# Altium schematic sheet SY_HR08_MCU_POWER_V1.1.SchDoc
size A3; PageSetup: Record=PageOptions|CenterHorizontal=True|CenterVertical=True|PrintScale=0.71|XCorrection=1.00|YCorrection=1.00|PrintKind=2|BorderSize=5000000|LeftOffset=0|BottomOffset=0|Orientation=2|PaperLength=1000|PaperWidth=1000|Scale=100|PaperSource=7|PrintQuality=-3|MediaType=1|DitherType=10|PrintScaleMode=1|PaperKind=A4|PaperIndex=9
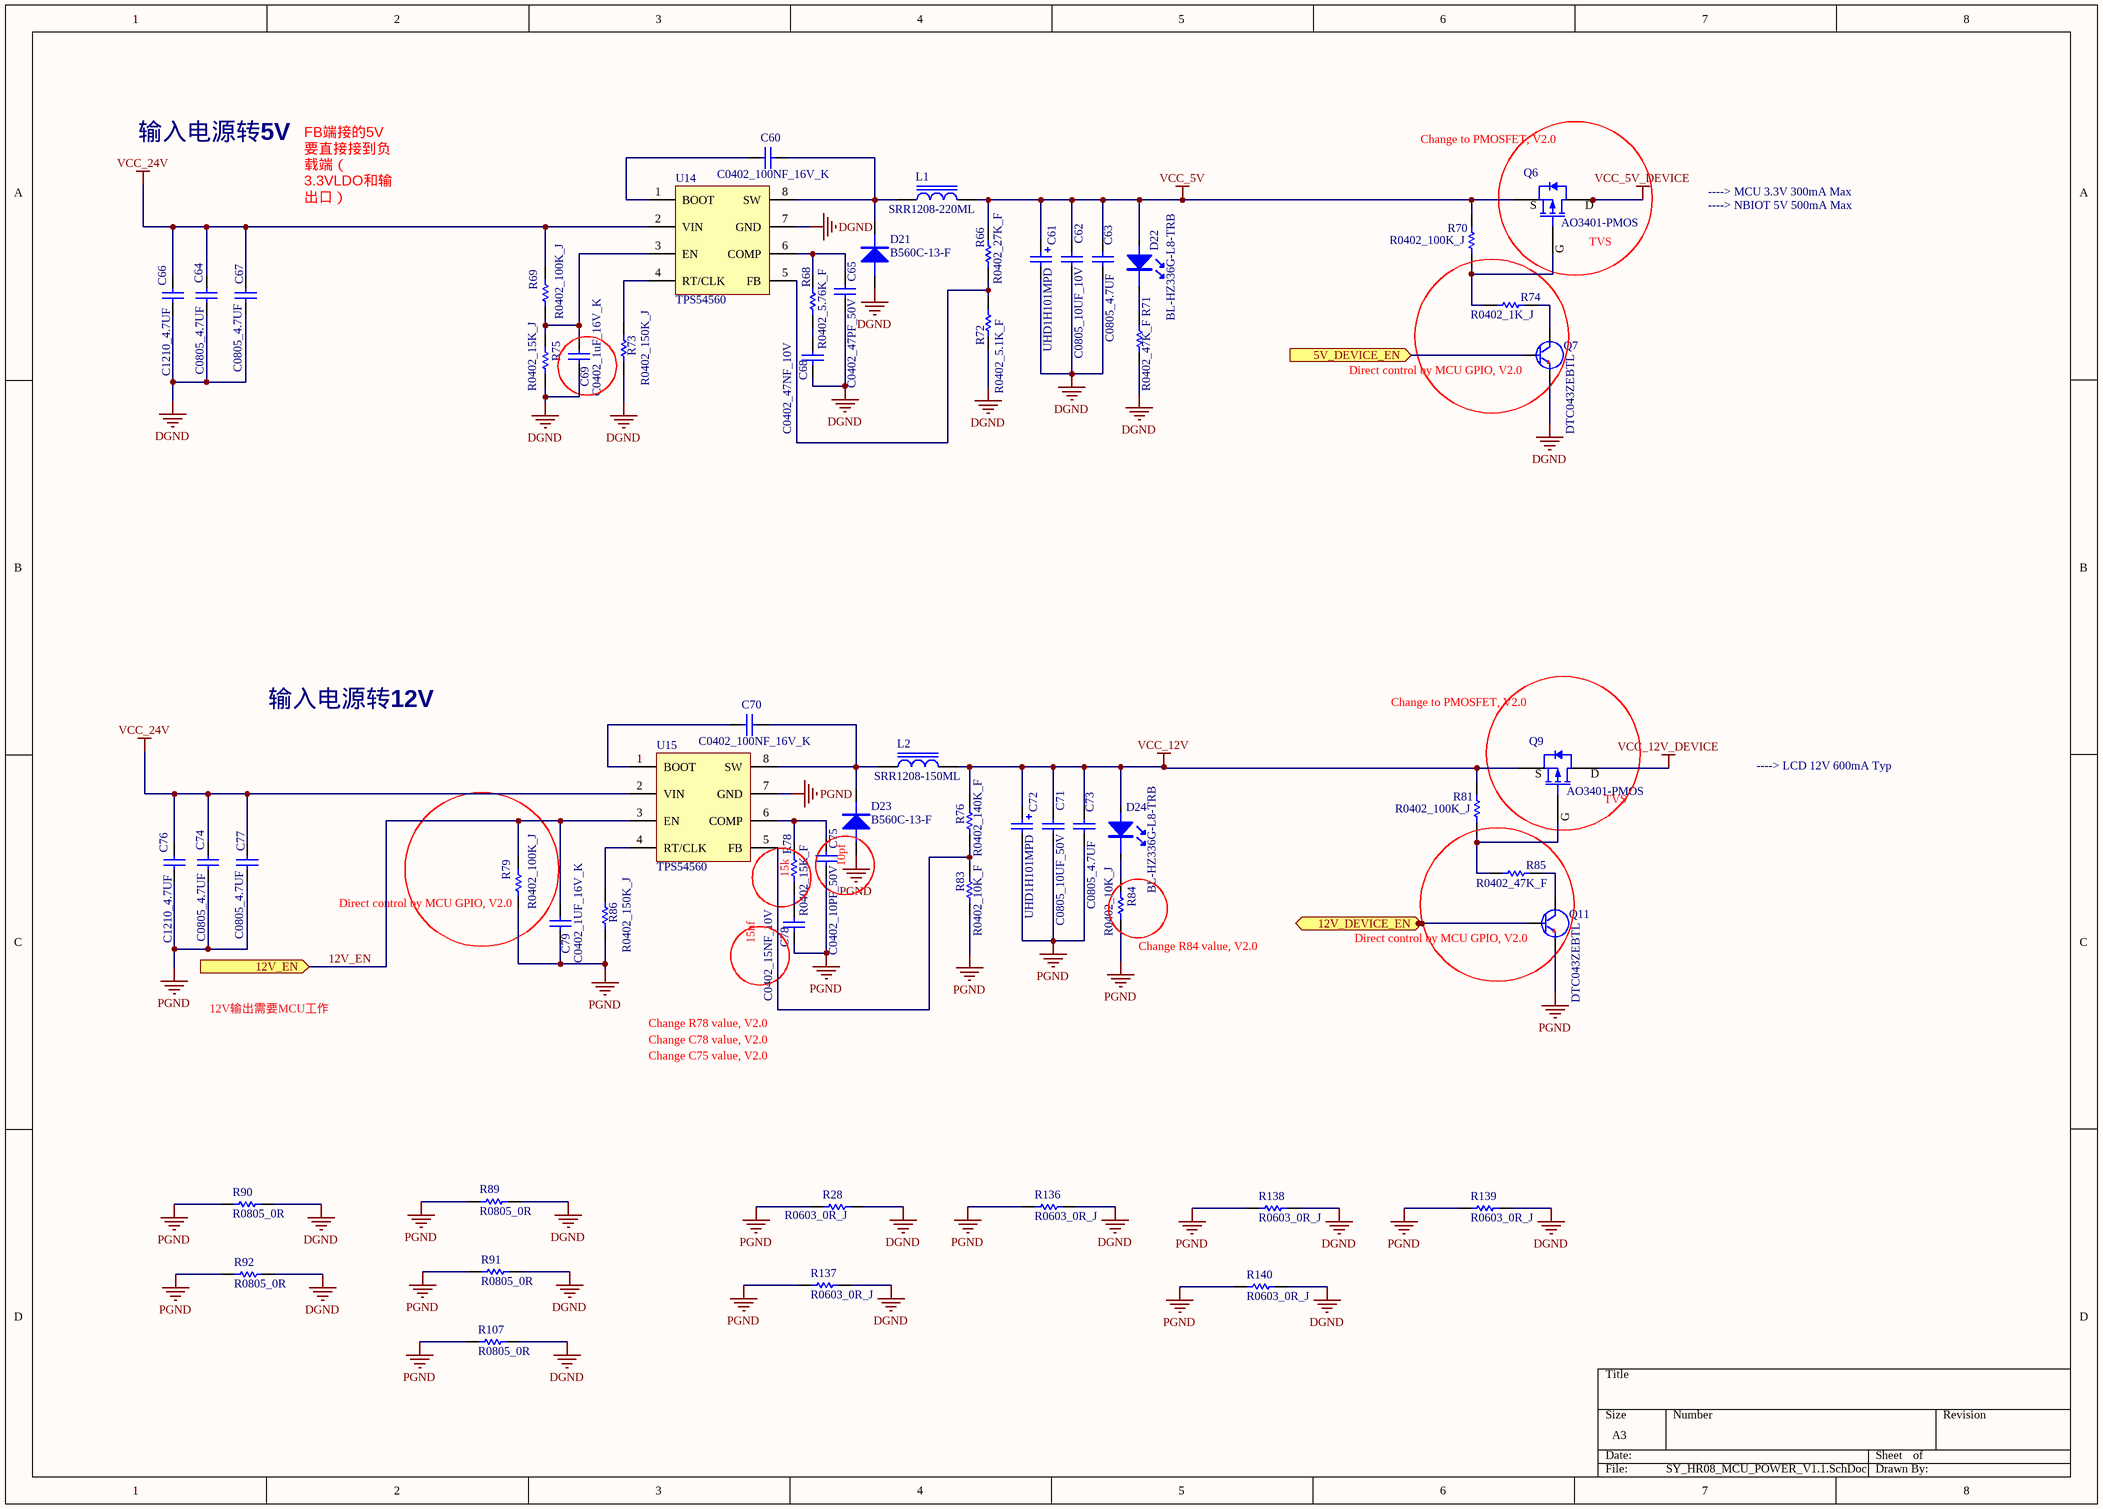
[diagram p0: SY_HR08_MCU_POWER_V1.1.SchDoc]

## Parts
C60  C0402_100NF_16V_K  [CAP0402_HQ]
C61  UHD1H101MPD  [UHD1H101MPD]
C62  C0805_10UF_10V  [CAP0805-B]
C63  C0805_4.7UF  [CAP0805]
C64  C0805_4.7UF  [CAP0805]
C65  C0402_47PF_50V  [CAP0402_HQ]
C66  C1210_4.7UF  [C1210]
C67  C0805_4.7UF  [CAP0805]
C68  C0402_47NF_10V  [CAP0402_HQ]
C69  C0402_1uF_16V_K  [CAP0402_HQ]
C70  C0402_100NF_16V_K  [CAP0402_HQ]
C71  C0805_10UF_50V  [CAP0805-B]
C72  UHD1H101MPD  [UHD1H101MPD]
C73  C0805_4.7UF  [CAP0805]
C74  C0805_4.7UF  [CAP0805]
C75  C0402_10PF_50V  [CAP0402_HQ]
C76  C1210_4.7UF  [C1210]
C77  C0805_4.7UF  [CAP0805]
C78  C0402_15NF_10V  [CAP0402_HQ]
C79  C0402_1UF_16V_K  [CAP0402_HQ]
D21  B560C-13-F  [B540C-13-F]
D22  BL-HZ336G-L8-TRB  [LED_1.6_0.8_0.4]
D23  B560C-13-F  [B540C-13-F]
D24  BL-HZ336G-L8-TRB  [LED_1.6_0.8_0.4]
L1  SRR1208-220ML  [SRR1208]
L2  SRR1208-150ML  [SRR1208]
Q6  AO3401-PMOS  [AO3400]
Q7  DTC043ZEBTL  [DTC043ZEBTL$2F$$2F$DTC143ZE$2F$$2F$LDTC143ZET1G]
Q9  AO3401-PMOS  [AO3400]
Q11  DTC043ZEBTL  [DTC043ZEBTL$2F$$2F$DTC143ZE$2F$$2F$LDTC143ZET1G]
R28  R0603_0R_J  [RES0603-A]
R66  R0402_27K_F  [RES0402_HQ]
R68  R0402_5.76K_F  [RES0402_HQ]
R69  R0402_100K_J  [RES0402_HQ]
R70  R0402_100K_J  [RES0402_HQ]
R71  R0402_47K_F  [RES0402_HQ]
R72  R0402_5.1K_F  [RES0402_HQ]
R73  R0402_150K_J  [RES0402_HQ]
R74  R0402_1K_J  [RES0402_HQ]
R75  R0402_15K_J  [RES0402_HQ]
R76  R0402_140K_F  [RES0402_HQ]
R78  R0402_15K_F  [RES0402_HQ]
R79  R0402_100K_J  [RES0402_HQ]
R81  R0402_100K_J  [RES0402_HQ]
R83  R0402_10K_F  [RES0402_HQ]
R84  R0402_10K_J  [RES0402_HQ]
R85  R0402_47K_F  [RES0402_HQ]
R86  R0402_150K_J  [RES0402_HQ]
R89  R0805_0R  [RES0805]
R90  R0805_0R  [RES0805]
R91  R0805_0R  [RES0805]
R92  R0805_0R  [RES0805]
R107  R0805_0R  [RES0805]
R136  R0603_0R_J  [RES0603-A]
R137  R0603_0R_J  [RES0603-A]
R138  R0603_0R_J  [RES0603-A]
R139  R0603_0R_J  [RES0603-A]
R140  R0603_0R_J  [RES0603-A]
U14  TPS54560  [TPS54560]
U15  TPS54560  [TPS54560]

## Ports
5V_DEVICE_EN (in), 12V_DEVICE_EN (in), 12V_EN (in)

## Nets
DGND: C61.2 C62.1 C63.1 C64.1 C65.1 C66.1 C67.1 C68.1 C69.1 D21.2 Q7.2(E) R28.2 R71.1 R72.1 R73.1 R75.1 R89.2 R90.2 R91.2 R92.2 R107.2 R136.2 R137.2 R138.2 R139.2 R140.2 U14.7(GND)
PGND: C71.1 C72.2 C73.1 C74.1 C75.1 C76.1 C77.1 C78.1 C79.1 D23.2 Q11.2(E) R28.1 R79.1 R83.1 R84.1 R86.1 R89.1 R90.1 R91.1 R92.1 R107.1 R136.1 R137.1 R138.1 R139.1 R140.1 U15.7(GND)
VCC_5V: C61.1 C62.2 C63.2 D22.2 L1.2 Q6.2(S) R66.2 R70.2
VCC_5V_DEVICE: Q6.3(D)
VCC_12V: C71.2 C72.1 C73.2 D24.2 L2.2 Q9.2(S) R76.2 R81.2
VCC_12V_DEVICE: Q9.3(D)
VCC_24V: C64.2 C66.2 C67.2 C74.2 C76.2 C77.2 R69.2 U14.2(VIN) U15.2(VIN)
5V_DEVICE_EN: Q7.1(B) ; port 5V_DEVICE_EN
12V_DEVICE_EN: Q11.1(B) ; port 12V_DEVICE_EN
12V_EN: C79.2 R79.2 U15.3(EN) ; port 12V_EN
NetC60_1: C60.1 D21.1 L1.1 U14.8(SW)
NetC60_2: C60.2 U14.1(BOOT)
NetC65_2: C65.2 R68.2 U14.6(COMP)
NetC68_2: C68.2 R68.1
NetC69_2: C69.2 R69.1 R75.2 U14.3(EN)
NetC70_1: C70.1 D23.1 L2.1 U15.8(SW)
NetC70_2: C70.2 U15.1(BOOT)
NetC75_2: C75.2 R78.2 U15.6(COMP)
NetC78_2: C78.2 R78.1
NetD22_1: D22.1 R71.2
NetD24_1: D24.1 R84.2
NetQ6_1: Q6.1(G) R70.1 R74.2
NetQ7_3: Q7.3(C) R74.1
NetQ9_1: Q9.1(G) R81.1 R85.2
NetQ11_3: Q11.3(C) R85.1
NetR66_1: R66.1 R72.2 U14.5(FB)
NetR73_2: R73.2 U14.4(RT/CLK)
NetR76_1: R76.1 R83.2 U15.5(FB)
NetR86_2: R86.2 U15.4(RT/CLK)

## Notes on the sheet
- 输入电源转5V
- Change to PMOSFET, V2.0
- FB端接的5V要直接接到负载端（3.3VLDO和输出口）
- (near Q6) TVS
- ----> MCU 3.3V 300mA Max
- ----> NBIOT 5V 500mA Max
- (near Q7) Direct control by MCU GPIO, V2.0
- 输入电源转12V
- ----> LCD 12V 600mA Typ
- (near Q9) TVS
- (near R79) Direct control by MCU GPIO, V2.0
- (near R78) 15k
- 10pf
- 15nf
- (near R84) Change R84 value, V2.0
- (near Q11) Direct control by MCU GPIO, V2.0
- 12V输出需要MCU工作
- Change C78 value, V2.0
- Change C75 value, V2.0
- Change R78 value, V2.0

## Library data of the parts
C60 C69 C70 C79 = C0402_100NF_16V_K: 电容_100nF_0402_X7R_16V_K; Geometry.Height: 0.55mm; Value: 100NF
C61 C72 = UHD1H101MPD: 铝电解电容_100uF_80115_50V_20%; Manufacturer: nichicon; Geometry.Height: 12mm; Value: UHD1H101MPD
C62 C71 = C0805_10UF_10V: 电容_10uF_0805_X5R_10V_K
C63 C64 C67 C73 C74 C77 = C0805_4.7UF: 电容_4.7uF_0805_X5R_50V_K; Geometry.Height: 1.45mm
C65 C75 = C0402_47PF_50V: 电容47pF(0402-COG-50V-J)
C66 C76 = C1210_4.7UF: 电容_4.7uF_1210_X7R_50V_K; Geometry.Height: 2.7mm; Value: C1210_4.7UF
C68 C78 = C0402_47NF_10V: 电容47nF(0402-X7R-10V-K)
D21 D23 = B560C-13-F: 肖特基二极管_5A_SMC
D22 D24 = BL-HZ336G-L8-TRB: LED_(白色_0603_2.8V)_(HUE仅收5-5,5-6,5-7的标示，CAE仅收含P的标示); Manufacturer: Bright(佰鸿); Geometry.Height: 0.6mm
L1 = SRR1208-220ML: 功率电感_22uH_12.7*12.7*8.5mm_4A(Irat )_3.5A(Irms)_20%
L2 = SRR1208-150ML: 功率电感_15uH_12.7*12.7*8.5mm_4A(Irat )_3.5A(Irms)_20%
Q7 Q11 = DTC043ZEBTL: NPN三极管_100mA_EMT3F
R28 R136-R140 = R0603_0R_J: 电阻0R(0603-0.1W-J)
R66 = R0402_27K_F: 电阻_27K_0402_1/16W_F
R68 R78 = R0402_5.76K_F: 电阻_5.76K_0402_1/16W_F
R69 R70 R74 R79 R81 R85 = R0402_100K_J: 电阻100K(0402-0.0625W-J)
R71 = R0402_10K_J: 电阻10K(0402-0.0625W-J)
R72 = R0402_5.1K_F: 电阻5.1K(0402-0.0625W-J)
R73 R86 = R0402_150K_J: 电阻150K(0402-0.0625w-J)
R75 R84 = R0402_15K_J: 电阻15K(0402-0.0625W-J)
R76 = R0402_140K_F: 电阻_140K_0402_1/16W_F
R83 = R0402_10K_F: 电阻_10K_0402_1/16W_F
R89-R92 R107 = R0805_0R: 电阻0R(0805-0.125W-J); Value: 0R
U14 U15 = TPS54560: Step Down DC-DC Converter; Manufacturer: TI; Geometry.Height: 1.75mm